# Altium project Elreg_Sender.PrjPCB
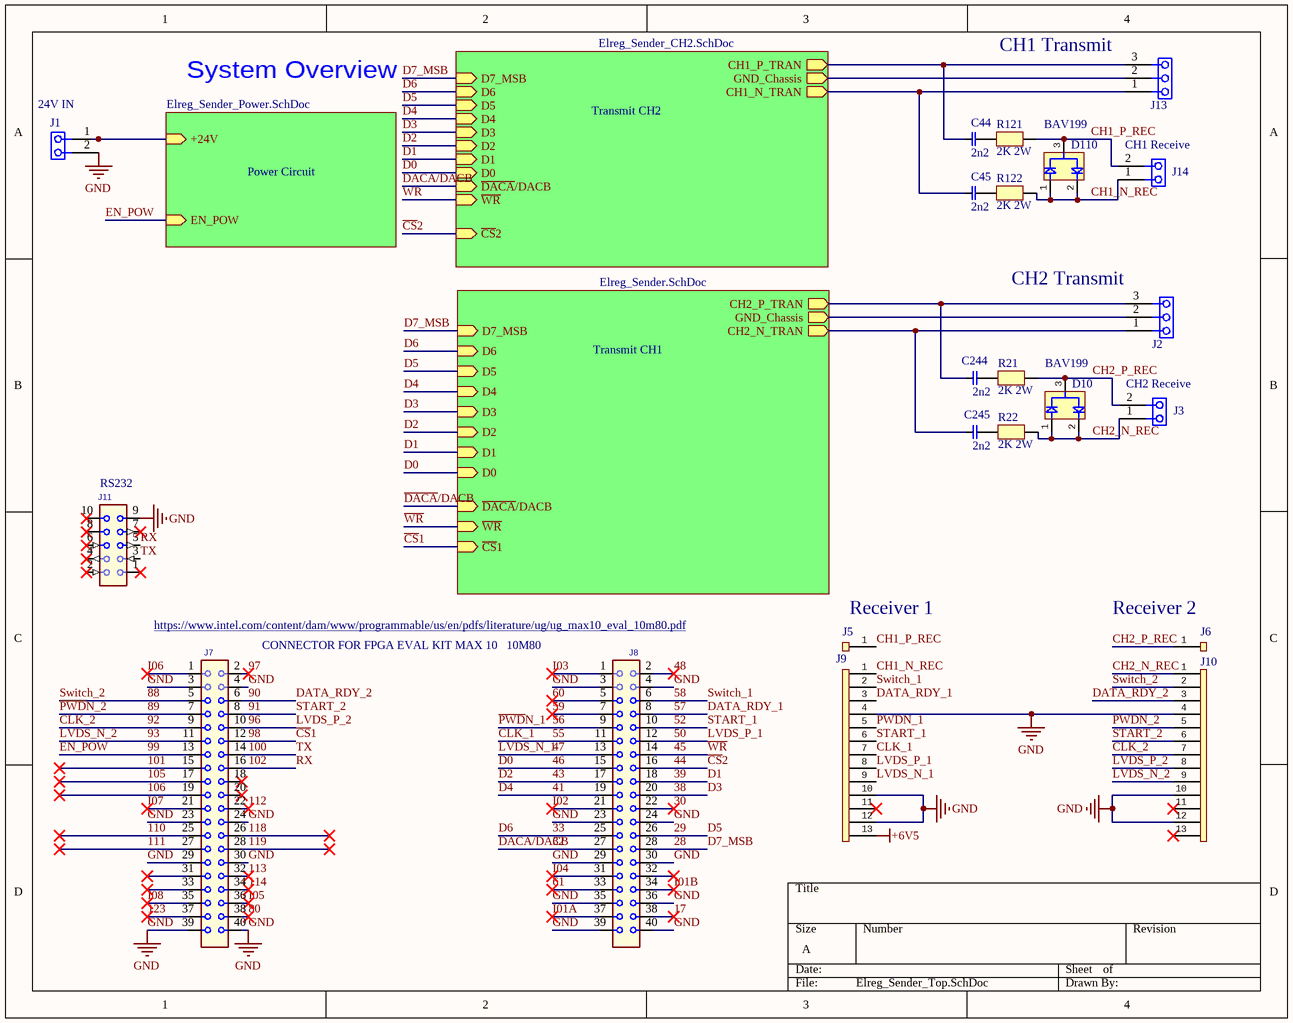
[diagram p0: Elreg_Sender_Top.SchDoc]
Revision: 1.0.1
4 sheets, 174 parts. Net scope: hierarchical (ports join the sheet entries above them; power ports are global).
Board file: Elreg_Sender.PcbDoc
Sheets:
  Elreg_Sender_Top.SchDoc
    Transmit CH1 = Elreg_Sender.SchDoc
    Power Circuit = Elreg_Sender_Power.SchDoc
    Transmit CH2 = Elreg_Sender_CH2.SchDoc

## Sheet Elreg_Sender_Top.SchDoc
size A; SheetNumber: 1

### Parts
C44  2n2  [CAP-1210]
C45  2n2  [CAP-1210]
C244  2n2  [CAP-1210]
C245  2n2  [CAP-1210]
D10  BAV199  [BAV199]
D110  BAV199  [BAV199]
J1  24V IN  [WAGO_2_pins]
J2  CONN 3x1  [WAGO-3_pins]  (value not drawn)
J3  CH2 Receive  [WAGO_2_pins]
J5  CON1_b  [CONN1 _b]  (value not drawn)
J6  CON1_b  [CONN1 _b]  (value not drawn)
J7  Header 2X20  [HEADER_2x20_2_54_1mm]  (value not drawn)
J8  Header 2X20  [HEADER_2x20_2_54_1mm]  (value not drawn)
J9  CON13  [CONN13]  (value not drawn)
J10  CON14  [CONN13]  (value not drawn)
J11  Header 2X5  [PIN-2X5-2.54-1.0]  (value not drawn)
J13  CONN 3x1  [WAGO-3_pins]  (value not drawn)
J14  CH1 Receive  [WAGO_2_pins]
R21  2K 2W  [RES2512]
R22  2K 2W  [RES2512]
R121  2K 2W  [RES2512]
R122  2K 2W  [RES2512]

### Sub-sheets
Power Circuit = Elreg_Sender_Power.SchDoc: +24V (in), EN_POW (in)
Transmit CH1 = Elreg_Sender.SchDoc: CH2_P_TRAN (out), CH2_N_TRAN (out), D0 (in), D1 (in), D2 (in), D3 (in), D4 (in), D5 (in), D6 (in), ~{CS}1 (in), ~{WR} (in), ~{DACA}/DACB (in), D7_MSB (in), GND_Chassis (out)
Transmit CH2 = Elreg_Sender_CH2.SchDoc: CH1_P_TRAN (out), CH1_N_TRAN (out), D0 (in), D1 (in), D2 (in), D3 (in), D4 (in), D5 (in), D6 (in), ~{WR} (in), ~{DACA}/DACB (in), D7_MSB (in), GND_Chassis (out), ~{CS}2 (in)

### Nets
+6V5: J9.13
GND: J1.2(Vout) J7.3(RX) J7.4(RTS) J7.23 J7.24 J7.29 J7.30 J7.39 J7.40 J8.3(RX) J8.4(RTS) J8.23 J8.24 J8.29 J8.30 J8.35 J8.36 J8.39 J8.40 J9.4 J9.10 J9.12 J10.4 J10.10 J10.12 J11.9(+PWR)
GND_chasis2: J13.2(Vout) ; sheet Transmit CH2/GND_Chassis
GND_chasis_1: J2.2(Vout) ; sheet Transmit CH1/GND_Chassis
17: J8.38
28: J8.28 ; sheet Transmit CH1/D7_MSB, sheet Transmit CH2/D7_MSB  [also labelled D7_MSB]
29: J8.26 ; sheet Transmit CH1/D5, sheet Transmit CH2/D5  [also labelled D5]
30: J8.22
32: J8.27 ; sheet Transmit CH1/~{DACA}/DACB, sheet Transmit CH2/~{DACA}/DACB  [also labelled ~{DACA}/DACB]
33: J8.25 ; sheet Transmit CH1/D6, sheet Transmit CH2/D6  [also labelled D6]
38: J8.20 ; sheet Transmit CH1/D3, sheet Transmit CH2/D3  [also labelled D3]
39: J8.18 ; sheet Transmit CH1/D1, sheet Transmit CH2/D1  [also labelled D1]
41: J8.19 ; sheet Transmit CH1/D4, sheet Transmit CH2/D4  [also labelled D4]
43: J8.17 ; sheet Transmit CH1/D2, sheet Transmit CH2/D2  [also labelled D2]
44: J8.16 ; sheet Transmit CH2/~{CS}2  [also labelled ~{CS}2]
45: J8.14 ; sheet Transmit CH1/~{WR}, sheet Transmit CH2/~{WR}  [also labelled ~{WR}]
46: J8.15 ; sheet Transmit CH1/D0, sheet Transmit CH2/D0  [also labelled D0]
47: J8.13 J9.9  [also labelled LVDS_N_1]
48: J8.2(DSR)
50: J8.12 J9.8  [also labelled LVDS_P_1]
52: J8.10 J9.6  [also labelled START_1]
55: J8.11 J9.7  [also labelled CLK_1]
56: J8.9(+PWR) J9.5  [also labelled ~{PWD}N_1]
57: J8.8 J9.3  [also labelled DATA_RDY_1]
58: J8.6(CTS) J9.2  [also labelled Switch_1]
59: J8.7(DTR)
60: J8.5(TX)
61: J8.33
80: J7.38
88: J7.5(TX) J10.2  [also labelled Switch_2]
89: J7.7(DTR) J10.5  [also labelled ~{PWD}N_2]
90: J7.6(CTS) J10.3  [also labelled DATA_RDY_2]
91: J7.8 J10.6  [also labelled START_2]
92: J7.9(+PWR) J10.7  [also labelled CLK_2]
93: J7.11 J10.9  [also labelled LVDS_N_2]
96: J7.10 J10.8  [also labelled LVDS_P_2]
97: J7.2(DSR)
98: J7.12 ; sheet Transmit CH1/~{CS}1  [also labelled ~{CS}1]
99: J7.13 ; sheet Power Circuit/EN_POW  [also labelled EN_POW]
100: J7.14 J11.3(RX)  [also labelled TX]
101: J7.15
102: J7.16 J11.5(TX)  [also labelled RX]
105: J7.17
106: J7.19
110: J7.25
111: J7.27
112: J7.22
113: J7.32
114: J7.34
118: J7.26
119: J7.28
123: J7.37
CH1_N_REC: D110.1(GND) D110.2(GND) J9.1 J14.1(Vout) R122.1(G)
CH1_P_REC: D110.3(GND) J5.1 J14.2(Vout) R121.1(G)
CH2_N_REC: D10.1(GND) D10.2(GND) J3.1(Vout) J10.1 R22.1(G)
CH2_P_REC: D10.3(GND) J3.2(Vout) J6.1 R21.1(G)
I01A: J8.37
I01B: J8.34
I02: J8.21
I03: J8.1
I04: J8.31
I05: J7.36
I06: J7.1
I07: J7.21
I08: J7.35
NetC44_1: C44.1(G) J13.3(Vout) ; sheet Transmit CH2/CH1_P_TRAN
NetC44_2: C44.2(G) R121.2(G)
NetC45_1: C45.1(G) J13.1(Vout) ; sheet Transmit CH2/CH1_N_TRAN
NetC45_2: C45.2(G) R122.2(G)
NetC244_1: C244.1(G) J2.3(Vout) ; sheet Transmit CH1/CH2_P_TRAN
NetC244_2: C244.2(G) R21.2(G)
NetC245_1: C245.1(G) J2.1(Vout) ; sheet Transmit CH1/CH2_N_TRAN
NetC245_2: C245.2(G) R22.2(G)
NetF1_1: J1.1(Vout) ; sheet Power Circuit/+24V

Not connected (* = marked no-connect by the designer): J7 18* 20* 31* 33*; J8 32*; J9 11(34)*; J10 11(34)* 13(36)*; J11 1* 2(DSR)* 4(RTS)* 6(CTS)* 7(DTR)* 8* 10*

### Notes on the sheet
- System Overview
- (near J13) CH1 Transmit
- (near J2) CH2 Transmit
- (near J11) RS232
- https://www.intel.com/content/dam/www/programmable/us/en/pdfs/literature/ug/ug_max10_eval_10m80.pdf
- (near J5) Receiver 1
- (near J6) Receiver 2
- (near J7) CONNECTOR FOR FPGA EVAL KIT MAX 10   10M80

### Library data of the parts
C44 C45 C244 C245 = C-1210: Manufacturer 1: Yageo; Manufacturer Part Number 1: CC1206KKX7RBBB332; Tolerance: ±10%; Voltage - Rated: 500V; Temperature Coefficient: X7R; Notification: Current market demand for these product types have resulted in fluctuating and extending lead times. Lead times may differ.; Description 1: CAP CER 3300PF 500V X7R 1206; Category 1: Capacitors; Packaging: Cut Tape (CT); Part Status: Active; Operating Temperature: -55°C ~ 125°C; Features: -; Ratings: -; Applications: General Purpose; Failure Rate: -; Mounting Type: Surface Mount, MLCC; Package / Case: 1206 (3216 Metric); Size / Dimension: 0.126" L x 0.063" W (3.20mm x 1.60mm); Height - Seated (Max): -; Thickness (Max): 0.057" (1.45mm); Lead Spacing: -; Lead Style: -; ComponentLink1URL: http://www.yageo.com/documents/recent/UPY-NP0X7R_MV_100-to-630V_21.pdf; ComponentLink1Description: http://www.yageo.com/documents/recent/UPY-NP0X7R_MV_100-to-630V_21.pdf; Supplier 1: Digi-Key; Supplier Part Number 1: 311-1506-1-ND; RoHS 1: RoHS Compliant; Stock 1: 4928; Pricing 1: 1=0.31, 10=0.214, 100=0.1085, 500=0.07424, 1000=0.06568 (USD)
J1 J3 J14 = 2x1 connector
J2 J13 = 3x1 connector
J7 J8 = HEADER_2x20_2.54_1: Manufacturer 1: TE Connectivity; Manufacturer Part Number 1: 826656-5; Description 1: Conn Unshrouded Header HDR 10 POS 2.54mm Solder ST Thru-Hole; Lead Time: 8 weeks; Peak Solder Temperature: 240 or 260 or 265 deg C; Supplier 1: Arrow; Supplier Part Number 1: 41579523S111189N5665; RoHS 1: CHINA ROHS: Compliant / EU ROHS: Compliant; Package Quantity: 4800; Termination Finish: Sn; EU_ROHS_PROD_EXEMPTION_BY_SUPP: N/R
J10 = CON13
J11 = HEADER_2x5_2.54: Conn Unshrouded Header HDR 10 POS 2.54mm Solder ST Thru-Hole; Manufacturer 1: TE Connectivity; Manufacturer Part Number 1: 826656-5; Lead Time: 8 weeks; Peak Solder Temperature: 240 or 260 or 265 deg C; Category 1: Connectors; Supplier 1: Arrow; Supplier Part Number 1: 41579523S111189N5665; RoHS 1: CHINA ROHS: Compliant / EU ROHS: Compliant; Description 1: Conn Unshrouded Header HDR 10 POS 2.54mm Solder ST Thru-Hole; Package Quantity: 4800; Termination Finish: Sn; EU_ROHS_PROD_EXEMPTION_BY_SUPP: N/R; ComponentLink1URL: http://components.arrow.com/partservice/dataview/altium/41579523S111189N5665?apiKey=aa438727d59eed98c4bed826d8d949c84cb5e685b92bf87346a0226bd2658797; ComponentLink1Description: http://components.arrow.com/partservice/dataview/altium/41579523S111189N5665?apiKey=aa438727d59eed98c4bed826d8d949c84cb5e685b92bf87346a0226bd2658797
R21 R22 R121 R122 = RES SMD 75K OHM 1% 2W 2512: Manufacturer 1: TE Connectivity Passive Product; Manufacturer Part Number 1: 352175KFT; Tolerance: ±1%; Temperature Coefficient: ±100ppm/°C; Category 1: Resistors; Packaging: Cut Tape (CT); Part Status: Active; Power (Watts): 2W; Composition: Thick Film; Features: -; Operating Temperature: -55°C ~ 155°C; Package / Case: 2512 (6432 Metric); Supplier Device Package: -; Size / Dimension: 0.248" L x 0.126" W (6.30mm x 3.20mm); Height - Seated (Max): 0.026" (0.65mm); Failure Rate: -; ComponentLink1URL: https://www.te.com/commerce/DocumentDelivery/DDEController?Action=srchrtrv&DocNm=9-1773463-5&DocType=DS&DocLang=English; ComponentLink1Description: https://www.te.com/commerce/DocumentDelivery/DDEController?Action=srchrtrv&DocNm=9-1773463-5&DocType=DS&DocLang=English; Supplier 1: Digi-Key; Supplier Part Number 1: A116077CT-ND; RoHS 1: RoHS Compliant; Description 1: RES SMD 75K OHM 1% 2W 2512; Stock 1: 1551; Pricing 1: 1=0.71, 10=0.521, 100=0.3037, 1000=0.17031 (USD)

## Sheet Elreg_Sender.SchDoc
size A; SheetNumber: 2
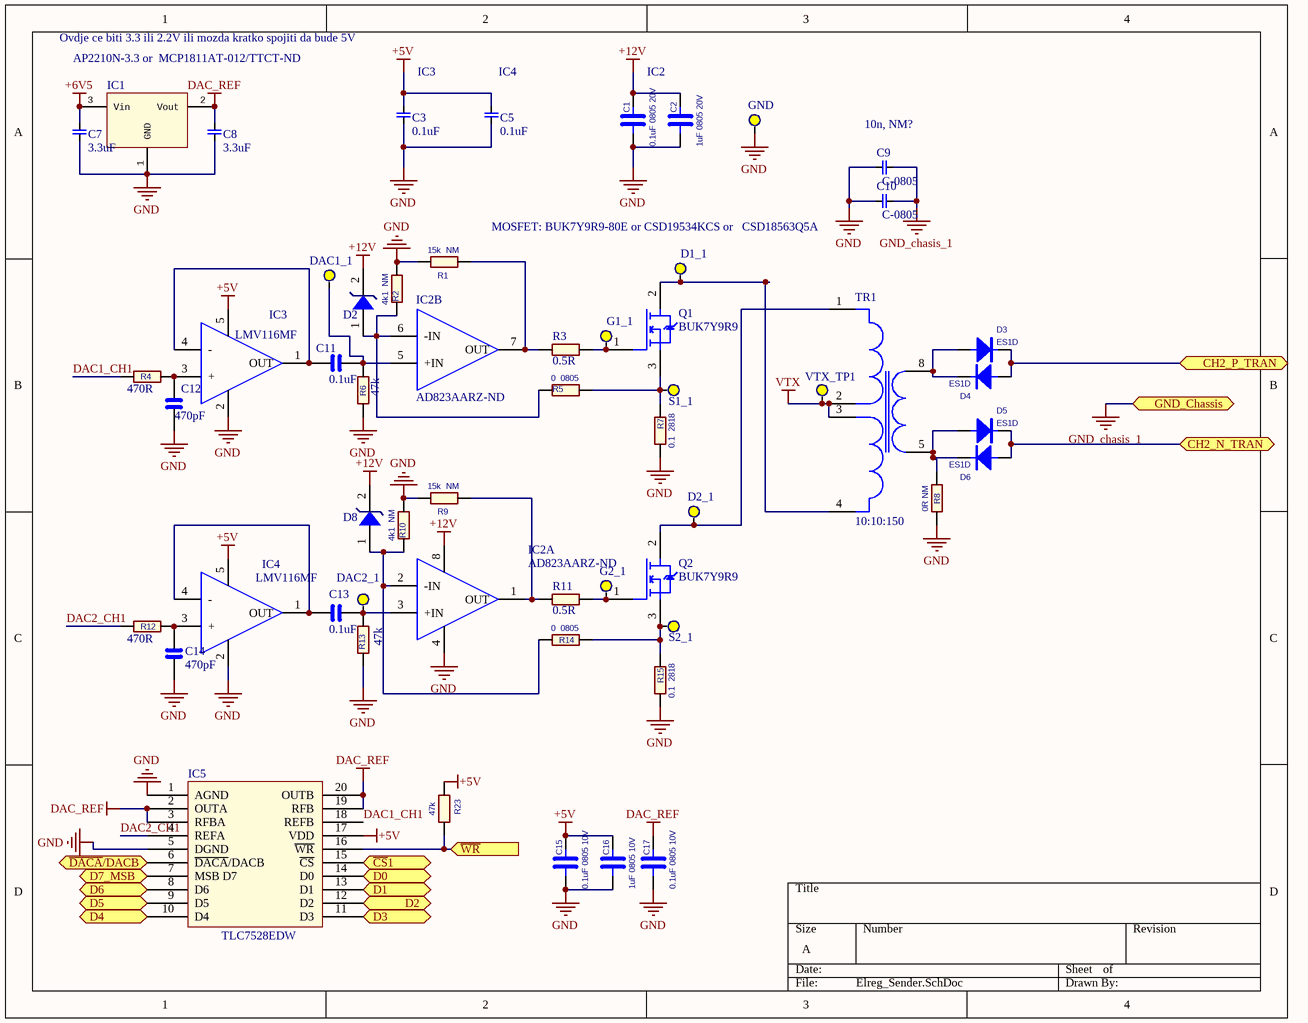
[diagram p1: Elreg_Sender.SchDoc]

### Parts
C1  0.1uF 0805 20V  [C-0603]
C2  1uF 0805 20V  [C-0603]
C3  0.1uF  [C-0603]
C5  0.1uF  [C-0603]
C7  3.3uF  [C-0805]
C8  3.3uF  [C-0805]
C9  C-0805  [C-0805]
C10  C-0805  [C-0805]
C11  0.1uF  [C-0603]
C12  470pF  [C-0603]
C13  0.1uF  [C-0603]
C14  470pF  [C-0603]
C15  0.1uF 0805 10V  [C-0603]
C16  1uF 0805 10V  [C-0603]
C17  0.1uF 0805 10V  [C-0603]
D1_1  Test_Point  [Test_Point]  (value not drawn)
D2  Zener 12V  [DFN380P520X45-2N]  (value not drawn)
D2_1  Test_Point  [Test_Point]  (value not drawn)
D3  ES1D  [SMA]
D4  ES1D  [SMA]
D5  ES1D  [SMA]
D6  ES1D  [SMA]
D8  Zener 12V  [DFN380P520X45-2N]  (value not drawn)
DAC1_1  DAC1  [Test_Point]  (value not drawn)
DAC2_1  DAC2_1  [Test_Point]  (value not drawn)
G1_1  Test_Point  [Test_Point]  (value not drawn)
G2_1  Test_Point  [Test_Point]  (value not drawn)
IC1  AP2210N-3.3 or  MCP1811AT-012/TTCT-ND  [SOT23-3]
IC2  AD823AARZ-ND  [TSOP65P280X110-8N]  (parts A,B of 2)
IC3  LMV116MF  [SOT-23-5]
IC4  LMV116MF  [SOT-23-5]
IC5  TLC7528EDW  [SOIC-20]
Q1  BUK7Y9R9  [BUK7Y9R)]
Q2  BUK7Y9R9  [BUK7Y9R)]
R1  15k  NM  [R-0603]
R2  4k1  NM  [R-0603]
R3  0.5R  [R-0603]
R4  470R  [R-0603]
R5  0  0805  [R-0603]
R6  47k  [R-0603]
R7  0.1  2818  [RES2818]
R8  0R NM  [RES-0805]
R9  15k  NM  [R-0603]
R10  4k1  NM  [R-0603]
R11  0.5R  [R-0603]
R12  470R  [R-0603]
R13  47k  [R-0603]
R14  0  0805  [R-0603]
R15  0.1  2818  [RES2818]
R23  47k  [R-0603]
S1_1  Test_Point  [Test_Point]  (value not drawn)
S2_1  Test_Point  [Test_Point]  (value not drawn)
TP1  GND  [Test_Point]
TR1  10:10:150  [Trafo_15x15]
VTX_TP1  Test_Point  [Test_Point]  (value not drawn)

### Ports
CH2_N_TRAN (bidir), CH2_P_TRAN (bidir), D0 (in), D1 (in), D2 (in), D3 (in), D4 (in), D5 (in), D6 (in), D7_MSB (in), GND_Chassis (bidir), ~{CS}1 (in), ~{DACA}/DACB (in), ~{WR} (in)

### Nets
+5V: C3.2(G) C5.2(G) C15.2 C16.2 IC3.5(+Vs) IC4.5(+Vs) IC5.17(VDD) R23.2
+6V5: C7.2(G) IC1.3(Vin)
+12V: C1.2 C2.2 D2.2(A) D8.2(A) IC2.8(+Vs)
DAC_REF: C8.2(G) C17.2 IC1.2(Vout) IC5.2(OUTA) IC5.3(RFBA) IC5.19(RFB) IC5.20(OUTB)
GND: C1.1 C2.1 C3.1(G) C5.1(G) C7.1(G) C8.1(G) C9.1(G) C10.1(G) C12.2 C14.1 C15.1 C16.1 C17.1 IC1.1(GND) IC2.4(-Vs) IC3.2(-Vs) IC4.2(-Vs) IC5.1(AGND) IC5.5(DGND) R1.1 R2.2 R6.1 R7.2 R8.1 R9.1 R10.2 R13.2 R15.2 TP1.1
GND_chasis_1: C9.2(G) C10.2(G) ; port GND_Chassis
VTX: TR1.2(G) TR1.3(G) VTX_TP1.1
28: IC5.7(MSB_D7) ; port D7_MSB
29: IC5.9(D5) ; port D5
32: IC5.6(~{DACA}/DACB) ; port ~{DACA}/DACB
33: IC5.8(D6) ; port D6
38: IC5.11(D3) ; port D3
39: IC5.13(D1) ; port D1
41: IC5.10(D4) ; port D4
43: IC5.12(D2) ; port D2
45: IC5.16(~{WR}) R23.1 ; port ~{WR}
46: IC5.14(D0) ; port D0
98: IC5.15(~{CS}) ; port ~{CS}1
DAC1_CH1: IC5.18(REFB) R4.1
DAC2_CH1: IC5.4(REFA) R12.1
NetC11_1: C11.1 DAC1_1.1 IC2.5(+IN) R6.2
NetC11_2: C11.2 IC3.1(OUT) IC3.4(-)
NetC12_1: C12.1 IC3.3(+) R4.2
NetC13_1: C13.1 DAC2_1.1 IC2.3(+IN) R13.1
NetC13_2: C13.2 IC4.1(OUT) IC4.4(-)
NetC14_2: C14.2 IC4.3(+) R12.2
NetC244_1: D3.2(C) D4.1(A) ; port CH2_P_TRAN
NetC245_1: D5.2(C) D6.1(A) ; port CH2_N_TRAN
NetD1_1_1: D1_1.1 Q1.2(G) TR1.4(G)
NetD2_1: D2.1(A) IC2.6(-IN) R2.1 R5.1
NetD2_1_1: D2_1.1 Q2.2(G) TR1.1(G)
NetD3_1: D3.1(A) D4.2(C) TR1.8(G)
NetD5_1: D5.1(A) D6.2(C) R8.2 TR1.5(G)
NetD8_1: D8.1(A) IC2.2(-IN) R10.1 R14.1
NetG1_1_1: G1_1.1 Q1.1(G) R3.2
NetG2_1_1: G2_1.1 Q2.1(G) R11.2
NetIC2_1: IC2.1(OUT) R9.2 R11.1
NetIC2_7: IC2.7(OUT) R1.2 R3.1
NetQ1_3: Q1.3(G) R5.2 R7.1 S1_1.1
NetQ2_3: Q2.3(G) R14.2 R15.1 S2_1.1

### Notes on the sheet
- Ovdje ce biti 3.3 ili 2.2V ili mozda kratko spojiti da bude 5V
- (near C3) IC3
- (near C5) IC4
- IC2
- (near C9) 10n, NM?
- MOSFET: BUK7Y9R9-80E or CSD19534KCS or   CSD18563Q5A

### Library data of the parts
C1 C2 C15-C17 = 0805CAPxxrrrrv: CAP CER rrrrUF xV x% type 0805
C3 C5 C7 C8 = C-0805_3_3uF: Manufacturer 1: Yageo; Manufacturer Part Number 1: CC1206KKX7RBBB332; Tolerance: ±10%; Voltage - Rated: 500V; Temperature Coefficient: X7R; Notification: Current market demand for these product types have resulted in fluctuating and extending lead times. Lead times may differ.; Description 1: CAP CER 3300PF 500V X7R 1206; Category 1: Capacitors; Packaging: Cut Tape (CT); Part Status: Active; Operating Temperature: -55°C ~ 125°C; Features: -; Ratings: -; Applications: General Purpose; Failure Rate: -; Mounting Type: Surface Mount, MLCC; Package / Case: 1206 (3216 Metric); Size / Dimension: 0.126" L x 0.063" W (3.20mm x 1.60mm); Height - Seated (Max): -; Thickness (Max): 0.057" (1.45mm); Lead Spacing: -; Lead Style: -; ComponentLink1URL: http://www.yageo.com/documents/recent/UPY-NP0X7R_MV_100-to-630V_21.pdf; ComponentLink1Description: http://www.yageo.com/documents/recent/UPY-NP0X7R_MV_100-to-630V_21.pdf; Supplier 1: Digi-Key; Supplier Part Number 1: 311-1506-1-ND; RoHS 1: RoHS Compliant; Stock 1: 4928; Pricing 1: 1=0.31, 10=0.214, 100=0.1085, 500=0.07424, 1000=0.06568 (USD)
C9 C10 = C-0805: Manufacturer 1: Yageo; Manufacturer Part Number 1: CC1206KKX7RBBB332; Tolerance: ±10%; Voltage - Rated: 500V; Temperature Coefficient: X7R; Notification: Current market demand for these product types have resulted in fluctuating and extending lead times. Lead times may differ.; Description 1: CAP CER 3300PF 500V X7R 1206; Category 1: Capacitors; Packaging: Cut Tape (CT); Part Status: Active; Operating Temperature: -55°C ~ 125°C; Features: -; Ratings: -; Applications: General Purpose; Failure Rate: -; Mounting Type: Surface Mount, MLCC; Package / Case: 1206 (3216 Metric); Size / Dimension: 0.126" L x 0.063" W (3.20mm x 1.60mm); Height - Seated (Max): -; Thickness (Max): 0.057" (1.45mm); Lead Spacing: -; Lead Style: -; ComponentLink1URL: http://www.yageo.com/documents/recent/UPY-NP0X7R_MV_100-to-630V_21.pdf; ComponentLink1Description: http://www.yageo.com/documents/recent/UPY-NP0X7R_MV_100-to-630V_21.pdf; Supplier 1: Digi-Key; Supplier Part Number 1: 311-1506-1-ND; RoHS 1: RoHS Compliant; Stock 1: 4928; Pricing 1: 1=0.31, 10=0.214, 100=0.1085, 500=0.07424, 1000=0.06568 (USD)
C11 C13 = C-0603_0_1u_10V: CAP CER 0.1UF 10V X7R 0603; Manufacturer Part Number: 885012206020
C12 C14 = C-0603_470p_10V: CAP CER 470p 10V C0G/NP0 0603; Manufacturer Part Number: 885012006014
D2 D8 = Zener 12V: Manufacturer 1: Comchip Technology; Manufacturer Part Number 1: CDBA140-G; Description 1: DIODE SCHOTTKY 40V 1A DO214AC; Category 1: Discrete Semiconductor Products; Diode Type: Schottky; Current - Average Rectified (Io): 1A; Speed: Fast Recovery =< 500ns, > 200mA (Io); Supplier 1: Digi-Key; Supplier Part Number 1: 641-1015-1-ND; RoHS 1: RoHS Compliant; Stock 1: 527910; Pricing 1: 1=0.37, 10=0.338, 100=0.1893, 500=0.1014, 1000=0.06895 (USD); Packaging: Cut Tape (CT); Part Status: Active; Capacitance @ Vr, F: -; Mounting Type: Surface Mount; Package / Case: DO-214AC, SMA; Supplier Device Package: DO-214AC (SMA); Operating Temperature - Junction: -65°C ~ 125°C; Base Part Number: CDBA140; ComponentLink1URL: http://www.comchiptech.com/admin/files/product/CDBA140-HF%20Thru192841.%20CDBA1100-HF%20RevB.pdf; ComponentLink1Description: http://www.comchiptech.com/admin/files/product/CDBA140-HF%20Thru192841.%20CDBA1100-HF%20RevB.pdf
D3-D6 = ES1x: Diode; Manufacturer: Fairchild/ON Semiconductor; Diode Type: Standard; Voltage - DC Reverse (Vr) (Max): 200V; Current - Average Rectified (Io): 1A; Voltage - Forward (Vf) (Max) @ If: 920mV @ 1A; Speed: Fast Recovery =< 500ns, > 200mA (Io); Reverse Recovery Time (trr): 15ns; Current - Reverse Leakage @ Vr: 5μA @ 200V; Capacitance @ Vr, F: 7pF @ 4V, 1MHz; Supplier 1: Digi-Key; Supplier Part Number 1: ES1DFSTR-ND; Manufacturer Part Number: ES1D; RoHS: RoHS Compliant; Category: Discrete Semiconductor Products; Stock 1: 135000; Pricing 1: 7500=0.0567, 15000=0.0504, 37500=0.04725, 52500=0.0419, 187500=0.04032 (USD); Packaging: Tape & Reel (TR); Part Status: Active; Mounting Type: Surface Mount; Package / Case: DO-214AC, SMA; Supplier Device Package: SMA (DO-214AC); Operating Temperature - Junction: -55°C ~ 150°C; ComponentLink1URL: https://www.fairchildsemi.com/datasheets/ES/ES1A.pdf; ComponentLink1Description: https://www.fairchildsemi.com/datasheets/ES/ES1A.pdf
DAC1_1 DAC2_1 TP1 = Test_Point
IC1 = AP2210N-3.3: AP2210N-3.3TRG1DICT-ND
IC2 = AD823AARZ-ND: IC OPAMP JFET 16MHZ RRO 8-MSOP; Supplier 1: Digi-Key; Supplier Part Number 1: AD823ARZ-ND
R1 R2 R5 R8-R10 R14 R23 = CRCW0805xxxxJN Default: RES xx OHM 1/8W 5% 0805 SMD; Category 1: Resistors
R3 R11 = RES-0805
R4 R12 = R-0603_470R: RES SMD 470 OHM 1% 0.4W 0805; Manufacturer 1: Vishay Dale; Manufacturer Part Number 1: CRCW0805150RJNEA; Manufacturer Part Number: ESR10EZPF1001; Description 1: RES 150 OHM 1/8W 5% 0805 SMD; Category 1: Resistors; Tolerance: ±5%; Power (Watts): 0.125W, 1/8W; Temperature Coefficient: ±200ppm/°C; Description 2: Thick Film Resistors - SMD 1/8watt 150ohms 5% 200ppm; Category 2: Thick Film Resistors - SMD; Power Rating: 125 mW (1/8 W); Resistance: 150 Ohms; Voltage Rating: 150 V; Description 3: VISHAY DALE - CRCW0805150RJNEA - RESISTOR, THICK FILM, 150 OHM, 125mW, 5%; Product Range: VISHAY - CRCW Series; Resistance Tolerance: ± 5%; Resistor Case Style: 0805 ^2012 Metric]; Resistor Element Type: Thick Film; No. of Pins: 2; Resistance (Ohms): 150; Supplier 1: Digi-Key; Supplier Part Number 1: 541-150ADKR-ND; RoHS 1: RoHS Compliant; Packaging: Digi-Reel®; Composition: Thick Film; Features: Automotive AEC-Q200 Qualified; Package / Case: 0805 (2012 Metric); Supplier Device Package: 0805 (2012 Metric); Size / Dimension: 0.079" L x 0.049" W (2.00mm x 1.25mm); Height: 0.020" (0.50mm); ComponentLink1URL: http://www.vishay.com/doc?20035; ComponentLink1Description: http://www.vishay.com/doc?20035; Supplier 2: Mouser; Supplier Part Number 2: 71-CRCW0805150RJNEA; Manufacturer 2: Vishay; Manufacturer Part Number 2: CRCW0805150RJNEA; RoHS 2: RoHS Compliant By Exemption; Dimensions: 1.25 mm W x 2 mm L x 0.45 mm H; Operating Temperature Range: - 55 C to + 155 C; Product: Thick Film Resistors SMD; Series: CRCW; Termination Style: SMD/SMT; Case Code - in: 0805; Case Code - mm: 2012; Product Category: 0805 Thick Film Chip Resistors; Standard Pack Qty: 5000; RoHS - Mouser: E; Minimum Order Quantity: 1; Reeling: True; ComponentLink2URL: http://www.mouser.com/ds/2/427/dcrcwe3-109170.pdf; ComponentLink2Description: http://www.mouser.com/ds/2/427/dcrcwe3-109170.pdf; Supplier 3: Farnell; Supplier Part Number 3: 1514819; Manufacturer 3: VISHAY DALE; Manufacturer Part Number 3: CRCW0805150RJNEA; RoHS 3: YES; ComponentLink3URL: http://www.farnell.com/cad/1552534.zip; ComponentLink3Description: http://www.farnell.com/cad/1552534.zip
R6 R13 = R-0603_47k: RES SMD 47k 1% 0.4W 0805; Manufacturer 1: Vishay Dale; Manufacturer Part Number 1: CRCW0805150RJNEA; Manufacturer Part Number: ESR10EZPF1001; Description 1: RES 150 OHM 1/8W 5% 0805 SMD; Category 1: Resistors; Tolerance: ±5%; Power (Watts): 0.125W, 1/8W; Temperature Coefficient: ±200ppm/°C; Description 2: Thick Film Resistors - SMD 1/8watt 150ohms 5% 200ppm; Category 2: Thick Film Resistors - SMD; Power Rating: 125 mW (1/8 W); Resistance: 150 Ohms; Voltage Rating: 150 V; Description 3: VISHAY DALE - CRCW0805150RJNEA - RESISTOR, THICK FILM, 150 OHM, 125mW, 5%; Product Range: VISHAY - CRCW Series; Resistance Tolerance: ± 5%; Resistor Case Style: 0805 ^2012 Metric]; Resistor Element Type: Thick Film; No. of Pins: 2; Resistance (Ohms): 150; Supplier 1: Digi-Key; Supplier Part Number 1: 541-150ADKR-ND; RoHS 1: RoHS Compliant; Packaging: Digi-Reel®; Composition: Thick Film; Features: Automotive AEC-Q200 Qualified; Package / Case: 0805 (2012 Metric); Supplier Device Package: 0805 (2012 Metric); Size / Dimension: 0.079" L x 0.049" W (2.00mm x 1.25mm); Height: 0.020" (0.50mm); ComponentLink1URL: http://www.vishay.com/doc?20035; ComponentLink1Description: http://www.vishay.com/doc?20035; Supplier 2: Mouser; Supplier Part Number 2: 71-CRCW0805150RJNEA; Manufacturer 2: Vishay; Manufacturer Part Number 2: CRCW0805150RJNEA; RoHS 2: RoHS Compliant By Exemption; Dimensions: 1.25 mm W x 2 mm L x 0.45 mm H; Operating Temperature Range: - 55 C to + 155 C; Product: Thick Film Resistors SMD; Series: CRCW; Termination Style: SMD/SMT; Case Code - in: 0805; Case Code - mm: 2012; Product Category: 0805 Thick Film Chip Resistors; Standard Pack Qty: 5000; RoHS - Mouser: E; Minimum Order Quantity: 1; Reeling: True; ComponentLink2URL: http://www.mouser.com/ds/2/427/dcrcwe3-109170.pdf; ComponentLink2Description: http://www.mouser.com/ds/2/427/dcrcwe3-109170.pdf; Supplier 3: Farnell; Supplier Part Number 3: 1514819; Manufacturer 3: VISHAY DALE; Manufacturer Part Number 3: CRCW0805150RJNEA; RoHS 3: YES; ComponentLink3URL: http://www.farnell.com/cad/1552534.zip; ComponentLink3Description: http://www.farnell.com/cad/1552534.zip
R7 R15 = CRCW0805xxxxJN Default: 0.1Ohm 10W; Manufacturer part number:: WSHP2818R1000FEB
TR1 = TRAFO_15x15: Coil Forme: B66414B6008T001; Yoke: B66414B2000X000; Cover Plate: B66414A7000X000; link PDF: https://www.tdk-electronics.tdk.com/inf/80/db/fer/efd_15_8_5.pdf

## Sheet Elreg_Sender_Power.SchDoc
size A; SheetNumber: 3
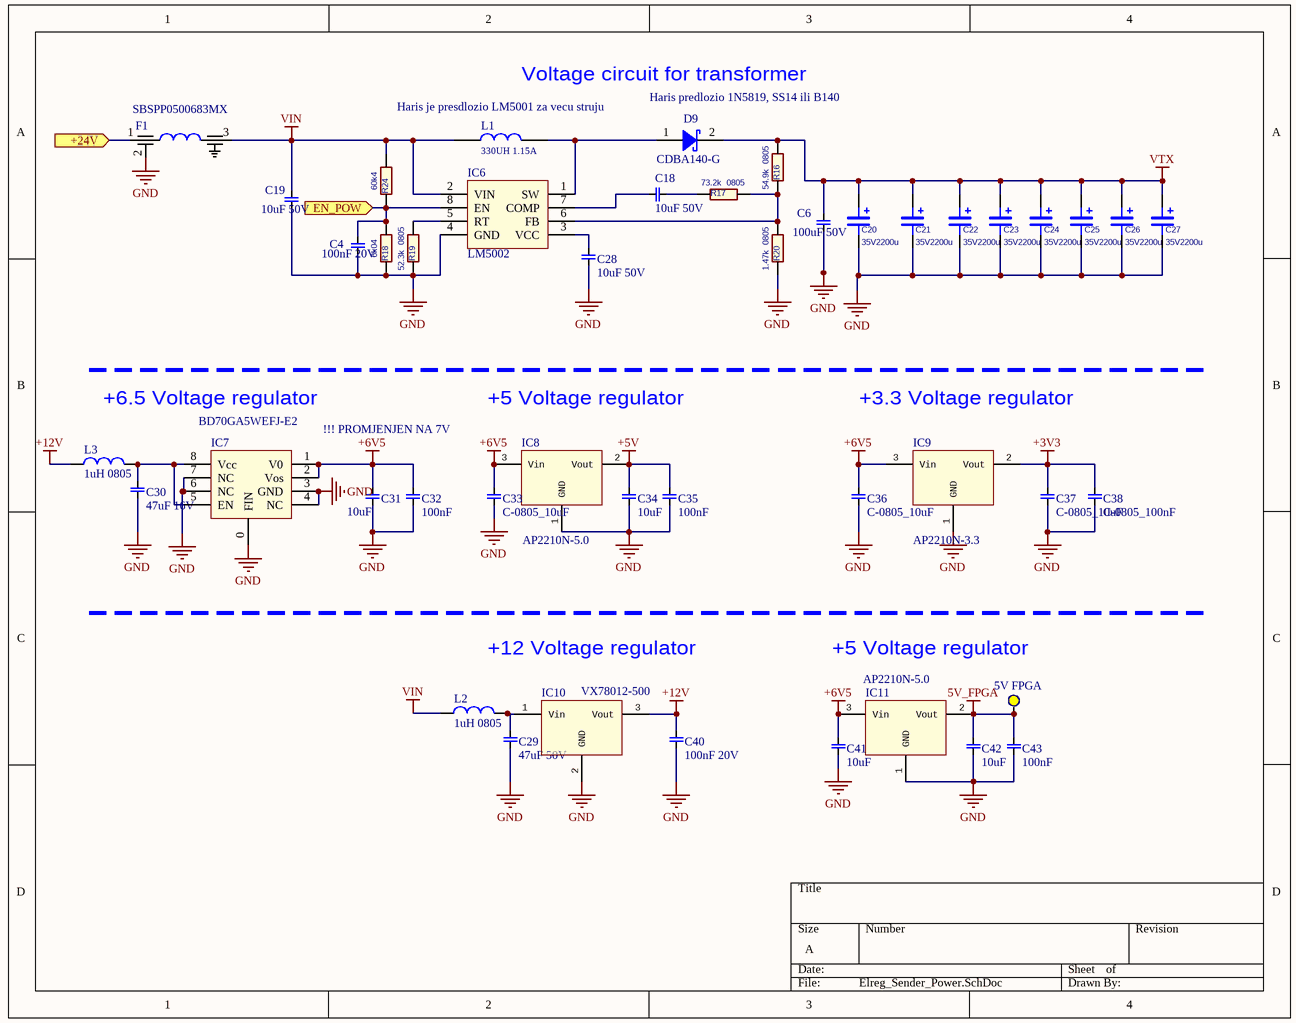
[diagram p2: Elreg_Sender_Power.SchDoc]

### Parts
C4  100nF 20V  [C-0603]
C6  100uF 50V  [C-0805]
C18  10uF 50V  [C-0603]
C19  10uF 50V  [C-0805]
C20  35V2200u  [CAP_16X25]
C21  35V2200u  [CAP_16X25]
C22  35V2200u  [CAP_16X25]
C23  35V2200u  [CAP_16X25]
C24  35V2200u  [CAP_16X25]
C25  35V2200u  [CAP_16X25]
C26  35V2200u  [CAP_16X25]
C27  35V2200u  [CAP_16X25]
C28  10uF 50V  [C-0603]
C29  47uF 50V  [C-0603]
C30  47uF 16V  [C-0603]
C31  10uF  [C-0603]
C32  100nF  [C-0603]
C33  C-0805_10uF  [C-0603]
C34  10uF  [C-0603]
C35  100nF  [C-0603]
C36  C-0805_10uF  [C-0805]
C37  C-0805_10uF  [C-0805]
C38  C-0805_100nF  [C-0805]
C40  100nF 20V  [C-0805]
C41  10uF  [C-0603]
C42  10uF  [C-0603]
C43  100nF  [C-0603]
D9  Manufacturer Part Number 1: CDBA140-G  [DFN380P520X45-2N]  (hidden comment: DIODE SCHOTTKY 40V 1A DO214AC)
F1  SBSPP0500683MX  [Filter_SBSPP0500]
IC6  LM5002  [SOIC127P600X205-8N]
IC7  BD70GA5WEFJ-E2  [HTSOP-J8]  (value not drawn)
IC8  AP2210N-5.0  [SOT23-3]
IC9  AP2210N-3.3  [SOT23-3]
IC10  VX78012-500  [VREG]
IC11  AP2210N-5.0  [SOT23-3]
L1  330UH 1.15A  [IND]
L2  1uH 0805  [0805]
L3  1uH 0805  [0805]
R16  54.9k  0805  [R-0603]
R17  73.2k  0805  [R-0603]
R18  6k04  [R-0603]
R19  52.3k  0805  [R-0603]
R20  1.47k  0805  [R-0603]
R24  60k4  [R-0603]
TP5  5V FPGA  [Test_Point]

### Ports
+24V (in), EN_POW (in)

### Nets
5V_FPGA: C42.1(G) C43.2(G) IC11.2(Vout) TP5.1
+3V3: C37.1(G) C38.2(G) IC9.2(Vout)
+5V: C34.1(G) C35.2(G) IC8.2(Vout)
+6V5: C31.1(G) C32.2(G) C33.1(G) C36.1(G) C41.1(G) IC7.1(V0) IC7.2(Vos) IC8.3(Vin) IC9.3(Vin) IC11.3(Vin)
+12V: C40.2(G) IC10.3(Vout) L3.1(A)
GND: C4.1(G) C6.2(G) C19.2(G) C20.2 C21.2 C22.2 C23.2 C24.2 C25.2 C26.2 C27.2 C28.2(G) C29.2(G) C30.1(G) C31.2(G) C32.1(G) C33.2(G) C34.2(G) C35.1(G) C36.2(G) C37.2(G) C38.1(G) C40.1(G) C41.2(G) C42.2(G) C43.1(G) F1.2 IC6.4(GND) IC7.0(FIN) IC7.3(GND) IC7.4(NC) IC7.6(NC) IC7.7(NC) IC8.1(GND) IC9.1(GND) IC10.2(GND) IC11.1(GND) R18.1 R19.1 R20.1
VIN: C19.1(G) F1.3 IC6.2(VIN) L1.1(A) L2.1(A) R24.2
VTX: C6.1(G) C20.1 C21.1 C22.1 C23.1 C24.1 C25.1 C26.1 C27.1 D9.2(A) R16.2
99: C4.2(G) IC6.8(EN) R18.2 R24.1 ; port EN_POW
NetC18_1: C18.1(G) IC6.7(COMP)
NetC18_2: C18.2(G) R17.1
NetC28_1: C28.1(G) IC6.3(VCC)
NetC29_1: C29.1(G) IC10.1(Vin) L2.2(A)
NetC30_2: C30.2(G) IC7.5(EN) IC7.8(Vcc) L3.2(A)
NetD9_1: D9.1(A) IC6.1(SW) L1.2(A)
NetF1_1: F1.1 ; port +24V
NetIC6_5: IC6.5(RT) R19.2
NetIC6_6: IC6.6(FB) R16.1 R17.2 R20.2

### Notes on the sheet
- Voltage circuit for transformer
- Haris predlozio 1N5819, SS14 ili B140
- (near L1) Haris je presdlozio LM5001 za vecu struju
- +6.5 Voltage regulator
- (near IC7) BD70GA5WEFJ-E2
- !!! PROMJENJEN NA 7V
- +5 Voltage regulator
- +3.3 Voltage regulator
- +12 Voltage regulator

### Library data of the parts
C4 C32 C35 C38 C40 C43 = C-0805_100nF: Manufacturer 1: Yageo; Manufacturer Part Number 1: CC1206KKX7RBBB332; Tolerance: ±10%; Voltage - Rated: 500V; Temperature Coefficient: X7R; Notification: Current market demand for these product types have resulted in fluctuating and extending lead times. Lead times may differ.; Description 1: CAP CER 3300PF 500V X7R 1206; Category 1: Capacitors; Packaging: Cut Tape (CT); Part Status: Active; Operating Temperature: -55°C ~ 125°C; Features: -; Ratings: -; Applications: General Purpose; Failure Rate: -; Mounting Type: Surface Mount, MLCC; Package / Case: 1206 (3216 Metric); Size / Dimension: 0.126" L x 0.063" W (3.20mm x 1.60mm); Height - Seated (Max): -; Thickness (Max): 0.057" (1.45mm); Lead Spacing: -; Lead Style: -; ComponentLink1URL: http://www.yageo.com/documents/recent/UPY-NP0X7R_MV_100-to-630V_21.pdf; ComponentLink1Description: http://www.yageo.com/documents/recent/UPY-NP0X7R_MV_100-to-630V_21.pdf; Supplier 1: Digi-Key; Supplier Part Number 1: 311-1506-1-ND; RoHS 1: RoHS Compliant; Stock 1: 4928; Pricing 1: 1=0.31, 10=0.214, 100=0.1085, 500=0.07424, 1000=0.06568 (USD)
C6 C18 C19 C28 C29 C31 C33 C34 C36 C37 C41 C42 = C-0805_10uF: Manufacturer 1: Yageo; Manufacturer Part Number 1: CC1206KKX7RBBB332; Tolerance: ±10%; Voltage - Rated: 500V; Temperature Coefficient: X7R; Notification: Current market demand for these product types have resulted in fluctuating and extending lead times. Lead times may differ.; Description 1: CAP CER 3300PF 500V X7R 1206; Category 1: Capacitors; Packaging: Cut Tape (CT); Part Status: Active; Operating Temperature: -55°C ~ 125°C; Features: -; Ratings: -; Applications: General Purpose; Failure Rate: -; Mounting Type: Surface Mount, MLCC; Package / Case: 1206 (3216 Metric); Size / Dimension: 0.126" L x 0.063" W (3.20mm x 1.60mm); Height - Seated (Max): -; Thickness (Max): 0.057" (1.45mm); Lead Spacing: -; Lead Style: -; ComponentLink1URL: http://www.yageo.com/documents/recent/UPY-NP0X7R_MV_100-to-630V_21.pdf; ComponentLink1Description: http://www.yageo.com/documents/recent/UPY-NP0X7R_MV_100-to-630V_21.pdf; Supplier 1: Digi-Key; Supplier Part Number 1: 311-1506-1-ND; RoHS 1: RoHS Compliant; Stock 1: 4928; Pricing 1: 1=0.31, 10=0.214, 100=0.1085, 500=0.07424, 1000=0.06568 (USD)
C20-C27 = CAP_2200uF_35V: Capacitor; Manufacturer: Kemet; Manufacturer Part Number: ESH228M035AM7AA; Capacitance: 2200µF; Tolerance: ±20%; Voltage Rating: 35V; Lifetime @ Temp.: 2000 Hrs @ 105°C; Supplier 1: Digi-Key; Supplier Part Number 1: 399-6572-ND; RoHS: RoHS Compliant; Category: Capacitors; Stock 1: 1972; Pricing 1: 1=0.98, 10=0.77, 50=0.6676, 100=0.5778, 250=0.5136, 500=0.43656, 1000=0.3852, 2500=0.35952, 5000=0.34668 (USD); Packaging: Bulk; ESR (Equivalent Series Resistance): -; Operating Temperature: -40°C ~ 105°C; Type: -; Applications: General Purpose; Ripple Current: -; Impedance: -; Lead Spacing: 0.295" (7.50mm); Size / Dimension: 0.630" Dia (16.00mm); Height - Seated (Max): 1.063" (27.00mm); Surface Mount Land Size: -; Mounting Type: Through Hole; Package / Case: Radial, Can; ComponentLink1URL: http://www.kemet.com/docfinder?Partnumber=ESH228M035AM7AA; ComponentLink1Description: http://www.kemet.com/docfinder?Partnumber=ESH228M035AM7AA
C30 = C-0805_3_3uF: as C3 on sheet Elreg_Sender; Packaging: Cut Tape (CT); Part Status: Active; Operating Temperature: -55°C ~ 125°C; Features: -; Ratings: -; Applications: General Purpose; Failure Rate: -; Mounting Type: Surface Mount, MLCC; Package / Case: 1206 (3216 Metric); Size / Dimension: 0.126" L x 0.063" W (3.20mm x 1.60mm); Height - Seated (Max): -; Thickness (Max): 0.057" (1.45mm); Lead Spacing: -; Lead Style: -; ComponentLink1URL: http://www.yageo.com/documents/recent/UPY-NP0X7R_MV_100-to-630V_21.pdf; ComponentLink1Description: http://www.yageo.com/documents/recent/UPY-NP0X7R_MV_100-to-630V_21.pdf; Supplier 1: Digi-Key; Supplier Part Number 1: 311-1506-1-ND; RoHS 1: RoHS Compliant; Stock 1: 4928; Pricing 1: 1=0.31, 10=0.214, 100=0.1085, 500=0.07424, 1000=0.06568 (USD)
D9 = DIODE SCHOTTKY 40V 1A DO214AC: Manufacturer 1: Comchip Technology; Category 1: Discrete Semiconductor Products; Speed: Fast Recovery =< 500ns, > 200mA (Io); Supplier 1: Digi-Key; Supplier Part Number 1: 641-1015-1-ND; RoHS 1: RoHS Compliant; Description 1: DIODE SCHOTTKY 40V 1A DO214AC; Stock 1: 527910; Pricing 1: 1=0.37, 10=0.338, 100=0.1893, 500=0.1014, 1000=0.06895 (USD); Packaging: Cut Tape (CT); Part Status: Active; Diode Type: Schottky; Current - Average Rectified (Io): 1A; Capacitance @ Vr, F: -; Mounting Type: Surface Mount; Package / Case: DO-214AC, SMA; Supplier Device Package: DO-214AC (SMA); Operating Temperature - Junction: -65°C ~ 125°C; Base Part Number: CDBA140; ComponentLink1URL: http://www.comchiptech.com/admin/files/product/CDBA140-HF%20Thru192841.%20CDBA1100-HF%20RevB.pdf; ComponentLink1Description: http://www.comchiptech.com/admin/files/product/CDBA140-HF%20Thru192841.%20CDBA1100-HF%20RevB.pdf
F1 = Filter_SBSPP0500683MX
IC6 = LM5002: Manufacturer 1: Texas Instruments; Manufacturer Part Number 1: LM5002SD/NOPB; Description 1: IC REG MULT CONFIG ISO ADJ 8WSON; Category 1: Integrated Circuits (ICs); Function: Step-Up, Step-Up/Step-Down; Output Configuration: Positive, Isolation Capable; Topology: Boost, Flyback, Forward Converter, SEPIC; Output Type: Adjustable; Number of Outputs: 1; Voltage - Input (Min): 3.1V; Voltage - Input (Max): 75V; Voltage - Output (Max): 76V (Switch); Current - Output: 400mA (Switch); Frequency - Switching: 50kHz ~ 1.5MHz; Synchronous Rectifier: No; Supplier 1: Digi-Key; Supplier Part Number 1: LM5002SD/NOPBTR-ND; RoHS 1: RoHS Compliant; Stock 1: 3000; Pricing 1: 1000=1.9656, 2000=1.86732, 5000=1.79712 (USD); Packaging: Tape & Reel (TR); Part Status: Active; Voltage - Output (Min/Fixed): 3.1V; Operating Temperature: -40°C ~ 125°C (TJ); Mounting Type: Surface Mount; Package / Case: 8-WDFN Exposed Pad; Supplier Device Package: 8-WSON (4x4); ComponentLink1URL: http://www.ti.com/lit/ds/symlink/lm5002.pdf; ComponentLink1Description: http://www.ti.com/lit/ds/symlink/lm5002.pdf; Base Part Number: LM5002
IC7 = BD70GA5WEFJ-E2: Manufacturer 1: Texas Instruments; Manufacturer Part Number 1: LM5002SD/NOPB; Description 1: IC REG MULT CONFIG ISO ADJ 8WSON; Category 1: Integrated Circuits (ICs); Function: Step-Up, Step-Up/Step-Down; Output Configuration: Positive, Isolation Capable; Topology: Boost, Flyback, Forward Converter, SEPIC; Output Type: Adjustable; Number of Outputs: 1; Voltage - Input (Min): 3.1V; Voltage - Input (Max): 75V; Voltage - Output (Max): 76V (Switch); Current - Output: 400mA (Switch); Frequency - Switching: 50kHz ~ 1.5MHz; Synchronous Rectifier: No; Supplier 1: Digi-Key; Supplier Part Number 1: LM5002SD/NOPBTR-ND; RoHS 1: RoHS Compliant; Stock 1: 3000; Pricing 1: 1000=1.9656, 2000=1.86732, 5000=1.79712 (USD); Packaging: Tape & Reel (TR); Part Status: Active; Voltage - Output (Min/Fixed): 3.1V; Operating Temperature: -40°C ~ 125°C (TJ); Mounting Type: Surface Mount; Package / Case: 8-WDFN Exposed Pad; Supplier Device Package: 8-WSON (4x4); ComponentLink1URL: http://www.ti.com/lit/ds/symlink/lm5002.pdf; ComponentLink1Description: http://www.ti.com/lit/ds/symlink/lm5002.pdf
IC8 IC11 = AP2210N-5: AP2210N-5.0TRG1DICT-ND
IC9 = AP2210N-3.3: AP2210N-3.3TRG1DICT-ND
L1 = FIXED IND 330UH 1.15A 580 MOHM: Manufacturer 1: BOURNS; Manufacturer Part Number 1: SRR1260-331K; Description 1: BOURNS - SRR1260-331K - INDUCTOR, SHIELDED, 330UH, 1.1A, SMD; Inductance: 330; RMS Current (Irms): 1.15; Inductor Construction: Shielded; Saturation Current (Isat): 1.1; Product Range: SRR1260 Series; Power Inductor Case: 12.5mm x 12.5mm x 6; Q Factor: 22; Supplier 1: Farnell; Supplier Part Number 1: 2458509; RoHS 1: YES; Stock 1: 143; Pricing 1: 1=0.843, 10=0.721, 25=0.661, 50=0.6, 100=0.552 (GBP); ComponentLink1URL: http://www.farnell.com/datasheets/2251090.pdf; ComponentLink1Description: http://www.farnell.com/datasheets/2251090.pdf
L2 L3 = induktor_0806: Manufacturer 1: BOURNS; Manufacturer Part Number 1: SRR1260-331K; Description 1: BOURNS - SRR1260-331K - INDUCTOR, SHIELDED, 330UH, 1.1A, SMD; Inductance: 330; RMS Current (Irms): 1.15; Inductor Construction: Shielded; Saturation Current (Isat): 1.1; Product Range: SRR1260 Series; Power Inductor Case: 12.5mm x 12.5mm x 6; Q Factor: 22; Supplier 1: Farnell; Supplier Part Number 1: 2458509; RoHS 1: YES; Stock 1: 143; Pricing 1: 1=0.843, 10=0.721, 25=0.661, 50=0.6, 100=0.552 (GBP); ComponentLink1URL: http://www.farnell.com/datasheets/2251090.pdf; ComponentLink1Description: http://www.farnell.com/datasheets/2251090.pdf
R16 R17 R19 R20 = CRCW0805xxxxJN Default: as R1 on sheet Elreg_Sender
R18 R24 = CRCW08051K00FKEA: RES 1 KOHM 1/8W 1% 0805 SMD; Manufacturer 1: Vishay Dale; Description 1: RES SMD 1K OHM 1% 1/8W 0805; Category 1: Resistors; Resistance (Ohms): 1k; Power (Watts): 0.125W, 1/8W; Temperature Coefficient: ±100ppm/°C; Description 2: Thick Film Resistors - SMD 1/8watt 1Kohms 1% 100ppm; Category 2: Thick Film Resistors - SMD; Power Rating: 125 mW (1/8 W); Resistance: 1 kOhms; Voltage Rating: 150 V; Brand: Vishay / Dale; Supplier 1: Digi-Key; Supplier Part Number 1: 541-1.00KCCT-ND; Manufacturer Part Number 1: CRCW08051K00FKEA; RoHS 1: RoHS Compliant; Packaging: Cut Tape (CT); Tolerance: ±1%; Composition: Thick Film; Features: Automotive AEC-Q200; Operating Temperature: -55°C ~ 155°C; Package / Case: 0805 (2012 Metric); Supplier Device Package: 0805 (2012 Metric); Size / Dimension: 0.079" L x 0.049" W (2.00mm x 1.25mm); Height: 0.020" (0.50mm); ComponentLink1URL: http://www.vishay.com/docs/20035/dcrcwe3.pdf; ComponentLink1Description: http://www.vishay.com/docs/20035/dcrcwe3.pdf; Supplier 2: Mouser; Supplier Part Number 2: 71-CRCW0805-1.0K-E3; Manufacturer 2: Vishay; Manufacturer Part Number 2: CRCW08051K00FKEA; RoHS 2: RoHS Compliant By Exemption; Length: 2 mm; Operating Temperature Range: - 55 C to + 155 C; Package/Case: 0805 (2012 metric); Product: Thick Film Resistors SMD; Series: CRCW; Termination Style: SMD/SMT; Width: 1.25 mm; Case Code - in: 0805; Case Code - mm: 2012; Product Category: 0805 Thick Film Chip Resistors; Standard Pack Qty: 5000; RoHS - Mouser: E; Minimum Order Quantity: 1; Reeling: True; ComponentLink2URL: http://www.mouser.com/ds/2/427/dcrcwe3-109170.pdf; ComponentLink2Description: http://www.mouser.com/ds/2/427/dcrcwe3-109170.pdf
TP5 = Test_Point

## Sheet Elreg_Sender_CH2.SchDoc
size A
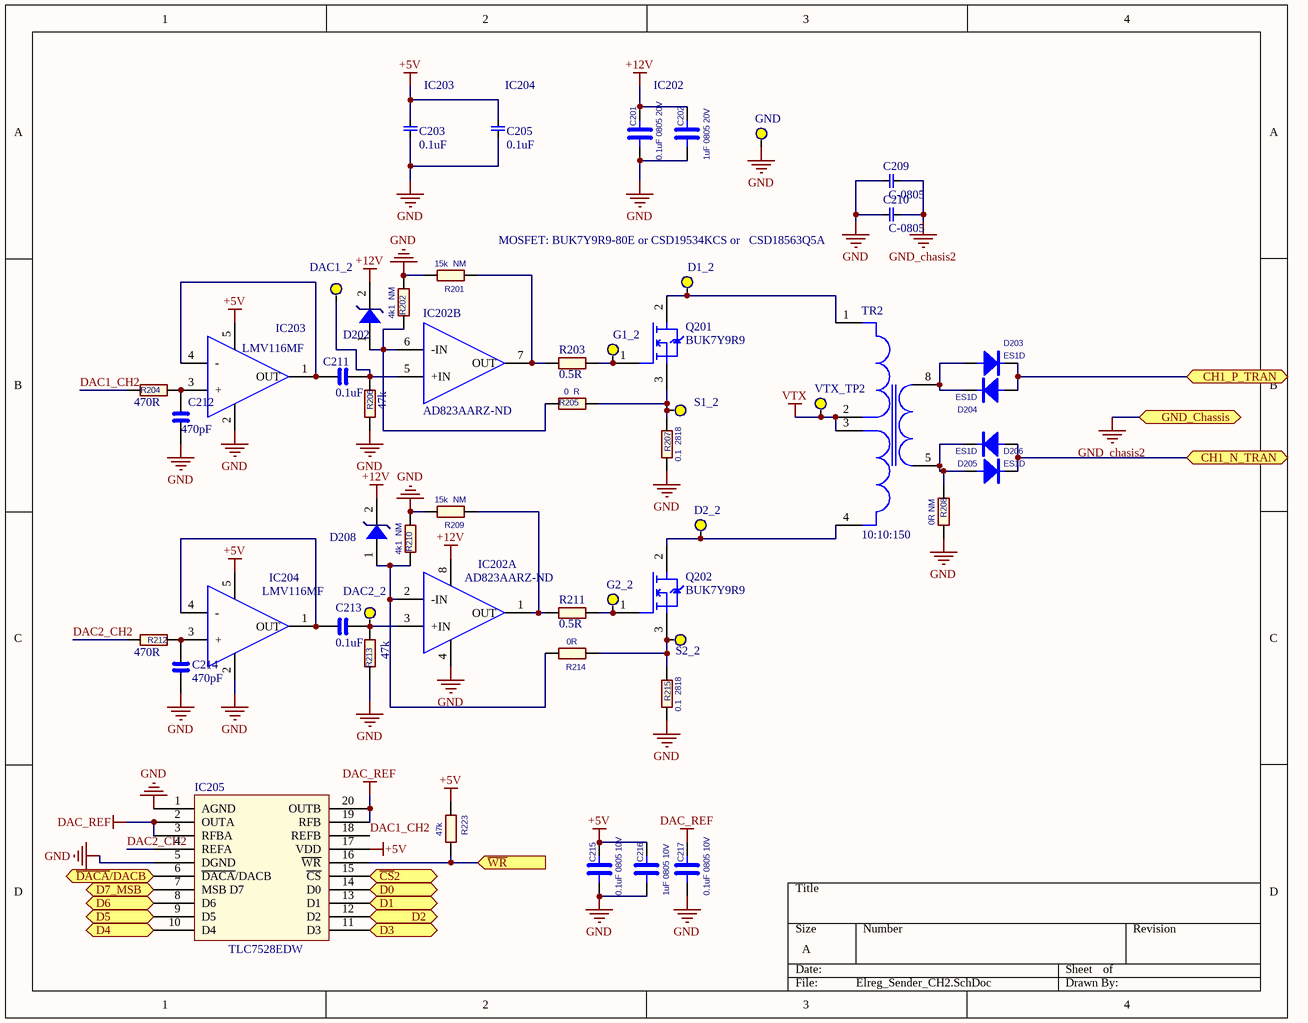
[diagram p3: Elreg_Sender_CH2.SchDoc]

### Parts
C201  0.1uF 0805 20V  [C-0603]
C202  1uF 0805 20V  [C-0603]
C203  0.1uF  [C-0603]
C205  0.1uF  [C-0603]
C209  C-0805  [C-0805]
C210  C-0805  [C-0805]
C211  0.1uF  [C-0603]
C212  470pF  [C-0603]
C213  0.1uF  [C-0603]
C214  470pF  [C-0603]
C215  0.1uF 0805 10V  [C-0603]
C216  1uF 0805 10V  [C-0603]
C217  0.1uF 0805 10V  [C-0603]
D1_2  Test_Point  [Test_Point]  (value not drawn)
D2_2  Test_Point  [Test_Point]  (value not drawn)
D202  Zener 12V  [DFN380P520X45-2N]  (value not drawn)
D203  ES1D  [SMA]
D204  ES1D  [SMA]
D205  ES1D  [SMA]
D206  ES1D  [SMA]
D208  Zener 12V  [DFN380P520X45-2N]  (value not drawn)
DAC1_2  DAC2_2  [Test_Point]  (value not drawn)
DAC2_2  DAC2_2  [Test_Point]  (value not drawn)
G1_2  Test_Point  [Test_Point]  (value not drawn)
G2_2  Test_Point  [Test_Point]  (value not drawn)
IC202  AD823AARZ-ND  [TSOP65P280X110-8N]  (parts A,B of 2)
IC203  LMV116MF  [SOT-23-5]
IC204  LMV116MF  [SOT-23-5]
IC205  TLC7528EDW  [SOIC-20]
Q201  BUK7Y9R9  [BUK7Y9R)]
Q202  BUK7Y9R9  [BUK7Y9R)]
R201  15k  NM  [R-0603]
R202  4k1  NM  [R-0603]
R203  0.5R  [R-0603]
R204  470R  [R-0603]
R205  0  R  [R-0603]
R206  47k  [R-0603]
R207  0.1  2818  [RES2818]
R208  0R NM  [RES-0805]
R209  15k  NM  [R-0603]
R210  4k1  NM  [R-0603]
R211  0.5R  [R-0603]
R212  470R  [R-0603]
R213  47k  [R-0603]
R214  0R  [R-0603]
R215  0.1  2818  [RES2818]
R223  47k  [R-0603]
S1_2  Test_Point  [Test_Point]  (value not drawn)
S2_2  Test_Point  [Test_Point]  (value not drawn)
TP6  GND  [Test_Point]
TR2  10:10:150  [Trafo_15x15]
VTX_TP2  Test_Point  [Test_Point]  (value not drawn)

### Ports
CH1_N_TRAN (bidir), CH1_P_TRAN (bidir), D0 (in), D1 (in), D2 (in), D3 (in), D4 (in), D5 (in), D6 (in), D7_MSB (in), GND_Chassis (bidir), ~{CS}2 (in), ~{DACA}/DACB (in), ~{WR} (in)

### Nets
+5V: C203.2(G) C205.2(G) C215.2 C216.2 IC203.5(+Vs) IC204.5(+Vs) IC205.17(VDD) R223.2
+12V: C201.2 C202.2 D202.2(A) D208.2(A) IC202.8(+Vs)
DAC_REF: C217.2 IC205.2(OUTA) IC205.3(RFBA) IC205.19(RFB) IC205.20(OUTB)
GND: C201.1 C202.1 C203.1(G) C205.1(G) C209.1(G) C210.1(G) C212.2 C214.1 C215.1 C216.1 C217.1 IC202.4(-Vs) IC203.2(-Vs) IC204.2(-Vs) IC205.1(AGND) IC205.5(DGND) R201.1 R202.2 R206.1 R207.2 R208.1 R209.1 R210.2 R213.2 R215.2 TP6.1
GND_chasis2: C209.2(G) C210.2(G) ; port GND_Chassis
VTX: TR2.2(G) TR2.3(G) VTX_TP2.1
28: IC205.7(MSB_D7) ; port D7_MSB
29: IC205.9(D5) ; port D5
32: IC205.6(~{DACA}/DACB) ; port ~{DACA}/DACB
33: IC205.8(D6) ; port D6
38: IC205.11(D3) ; port D3
39: IC205.13(D1) ; port D1
41: IC205.10(D4) ; port D4
43: IC205.12(D2) ; port D2
44: IC205.15(~{CS}) ; port ~{CS}2
45: IC205.16(~{WR}) R223.1 ; port ~{WR}
46: IC205.14(D0) ; port D0
DAC1_CH2: IC205.18(REFB) R204.1
DAC2_CH2: IC205.4(REFA) R212.1
NetC44_1: D203.2(C) D204.1(A) ; port CH1_P_TRAN
NetC45_1: D205.1(A) D206.2(C) ; port CH1_N_TRAN
NetC211_1: C211.1 DAC1_2.1 IC202.5(+IN) R206.2
NetC211_2: C211.2 IC203.1(OUT) IC203.4(-)
NetC212_1: C212.1 IC203.3(+) R204.2
NetC213_1: C213.1 DAC2_2.1 IC202.3(+IN) R213.1
NetC213_2: C213.2 IC204.1(OUT) IC204.4(-)
NetC214_2: C214.2 IC204.3(+) R212.2
NetD1_2_1: D1_2.1 Q201.2(G) TR2.1(G)
NetD2_2_1: D2_2.1 Q202.2(G) TR2.4(G)
NetD202_1: D202.1(A) IC202.6(-IN) R202.1 R205.1
NetD203_1: D203.1(A) D204.2(C) TR2.8(G)
NetD205_2: D205.2(C) D206.1(A) R208.2 TR2.5(G)
NetD208_1: D208.1(A) IC202.2(-IN) R210.1 R214.1
NetG1_2_1: G1_2.1 Q201.1(G) R203.2
NetG2_2_1: G2_2.1 Q202.1(G) R211.2
NetIC202_1: IC202.1(OUT) R209.2 R211.1
NetIC202_7: IC202.7(OUT) R201.2 R203.1
NetQ201_3: Q201.3(G) R205.2 R207.1 S1_2.1
NetQ202_3: Q202.3(G) R214.2 R215.1 S2_2.1

### Notes on the sheet
- IC203
- (near C205) IC204
- IC202
- MOSFET: BUK7Y9R9-80E or CSD19534KCS or   CSD18563Q5A

### Library data of the parts
C201 C202 C215-C217 = 0805CAPxxrrrrv: CAP CER rrrrUF xV x% type 0805
C203 C205 = C-0805_3_3uF: as C3 on sheet Elreg_Sender; Packaging: Cut Tape (CT); Part Status: Active; Operating Temperature: -55°C ~ 125°C; Features: -; Ratings: -; Applications: General Purpose; Failure Rate: -; Mounting Type: Surface Mount, MLCC; Package / Case: 1206 (3216 Metric); Size / Dimension: 0.126" L x 0.063" W (3.20mm x 1.60mm); Height - Seated (Max): -; Thickness (Max): 0.057" (1.45mm); Lead Spacing: -; Lead Style: -; ComponentLink1URL: http://www.yageo.com/documents/recent/UPY-NP0X7R_MV_100-to-630V_21.pdf; ComponentLink1Description: http://www.yageo.com/documents/recent/UPY-NP0X7R_MV_100-to-630V_21.pdf; Supplier 1: Digi-Key; Supplier Part Number 1: 311-1506-1-ND; RoHS 1: RoHS Compliant; Stock 1: 4928; Pricing 1: 1=0.31, 10=0.214, 100=0.1085, 500=0.07424, 1000=0.06568 (USD)
C209 C210 = C-0805: as C9 on sheet Elreg_Sender; Packaging: Cut Tape (CT); Part Status: Active; Operating Temperature: -55°C ~ 125°C; Features: -; Ratings: -; Applications: General Purpose; Failure Rate: -; Mounting Type: Surface Mount, MLCC; Package / Case: 1206 (3216 Metric); Size / Dimension: 0.126" L x 0.063" W (3.20mm x 1.60mm); Height - Seated (Max): -; Thickness (Max): 0.057" (1.45mm); Lead Spacing: -; Lead Style: -; ComponentLink1URL: http://www.yageo.com/documents/recent/UPY-NP0X7R_MV_100-to-630V_21.pdf; ComponentLink1Description: http://www.yageo.com/documents/recent/UPY-NP0X7R_MV_100-to-630V_21.pdf; Supplier 1: Digi-Key; Supplier Part Number 1: 311-1506-1-ND; RoHS 1: RoHS Compliant; Stock 1: 4928; Pricing 1: 1=0.31, 10=0.214, 100=0.1085, 500=0.07424, 1000=0.06568 (USD)
C211 C213 = C-0603_0_1u_10V: as C11 on sheet Elreg_Sender
C212 C214 = C-0603_470p_10V: as C12 on sheet Elreg_Sender
D202 D208 = Zener 12V: as D2 on sheet Elreg_Sender; Supplier 1: Digi-Key; Supplier Part Number 1: 641-1015-1-ND; RoHS 1: RoHS Compliant; Stock 1: 527910; Pricing 1: 1=0.37, 10=0.338, 100=0.1893, 500=0.1014, 1000=0.06895 (USD); Packaging: Cut Tape (CT); Part Status: Active; Capacitance @ Vr, F: -; Mounting Type: Surface Mount; Package / Case: DO-214AC, SMA; Supplier Device Package: DO-214AC (SMA); Operating Temperature - Junction: -65°C ~ 125°C; Base Part Number: CDBA140; ComponentLink1URL: http://www.comchiptech.com/admin/files/product/CDBA140-HF%20Thru192841.%20CDBA1100-HF%20RevB.pdf; ComponentLink1Description: http://www.comchiptech.com/admin/files/product/CDBA140-HF%20Thru192841.%20CDBA1100-HF%20RevB.pdf
D203-D206 = ES1x: as D3 on sheet Elreg_Sender; Supplier 1: Digi-Key; Supplier Part Number 1: ES1DFSTR-ND; Manufacturer Part Number: ES1D; RoHS: RoHS Compliant; Category: Discrete Semiconductor Products; Stock 1: 135000; Pricing 1: 7500=0.0567, 15000=0.0504, 37500=0.04725, 52500=0.0419, 187500=0.04032 (USD); Packaging: Tape & Reel (TR); Part Status: Active; Mounting Type: Surface Mount; Package / Case: DO-214AC, SMA; Supplier Device Package: SMA (DO-214AC); Operating Temperature - Junction: -55°C ~ 150°C; ComponentLink1URL: https://www.fairchildsemi.com/datasheets/ES/ES1A.pdf; ComponentLink1Description: https://www.fairchildsemi.com/datasheets/ES/ES1A.pdf
DAC1_2 DAC2_2 TP6 = Test_Point
IC202 = AD823AARZ-ND: IC OPAMP JFET 16MHZ RRO 8-MSOP; Supplier 1: Digi-Key; Supplier Part Number 1: AD823ARZ-ND
R201 R202 R205 R208-R210 R214 R223 = CRCW0805xxxxJN Default: as R1 on sheet Elreg_Sender
R203 R211 = RES-0805
R204 R212 = R-0603_470R: as R4 on sheet Elreg_Sender; Supplier 1: Digi-Key; Supplier Part Number 1: 541-150ADKR-ND; RoHS 1: RoHS Compliant; Packaging: Digi-Reel®; Composition: Thick Film; Features: Automotive AEC-Q200 Qualified; Package / Case: 0805 (2012 Metric); Supplier Device Package: 0805 (2012 Metric); Size / Dimension: 0.079" L x 0.049" W (2.00mm x 1.25mm); Height: 0.020" (0.50mm); ComponentLink1URL: http://www.vishay.com/doc?20035; ComponentLink1Description: http://www.vishay.com/doc?20035; Supplier 2: Mouser; Supplier Part Number 2: 71-CRCW0805150RJNEA; Manufacturer 2: Vishay; Manufacturer Part Number 2: CRCW0805150RJNEA; RoHS 2: RoHS Compliant By Exemption; Dimensions: 1.25 mm W x 2 mm L x 0.45 mm H; Operating Temperature Range: - 55 C to + 155 C; Product: Thick Film Resistors SMD; Series: CRCW; Termination Style: SMD/SMT; Case Code - in: 0805; Case Code - mm: 2012; Product Category: 0805 Thick Film Chip Resistors; Standard Pack Qty: 5000; RoHS - Mouser: E; Minimum Order Quantity: 1; Reeling: True; ComponentLink2URL: http://www.mouser.com/ds/2/427/dcrcwe3-109170.pdf; ComponentLink2Description: http://www.mouser.com/ds/2/427/dcrcwe3-109170.pdf; Supplier 3: Farnell; Supplier Part Number 3: 1514819; Manufacturer 3: VISHAY DALE; Manufacturer Part Number 3: CRCW0805150RJNEA; RoHS 3: YES; ComponentLink3URL: http://www.farnell.com/cad/1552534.zip; ComponentLink3Description: http://www.farnell.com/cad/1552534.zip
R206 R213 = R-0603_47k: as R6 on sheet Elreg_Sender; Supplier 1: Digi-Key; Supplier Part Number 1: 541-150ADKR-ND; RoHS 1: RoHS Compliant; Packaging: Digi-Reel®; Composition: Thick Film; Features: Automotive AEC-Q200 Qualified; Package / Case: 0805 (2012 Metric); Supplier Device Package: 0805 (2012 Metric); Size / Dimension: 0.079" L x 0.049" W (2.00mm x 1.25mm); Height: 0.020" (0.50mm); ComponentLink1URL: http://www.vishay.com/doc?20035; ComponentLink1Description: http://www.vishay.com/doc?20035; Supplier 2: Mouser; Supplier Part Number 2: 71-CRCW0805150RJNEA; Manufacturer 2: Vishay; Manufacturer Part Number 2: CRCW0805150RJNEA; RoHS 2: RoHS Compliant By Exemption; Dimensions: 1.25 mm W x 2 mm L x 0.45 mm H; Operating Temperature Range: - 55 C to + 155 C; Product: Thick Film Resistors SMD; Series: CRCW; Termination Style: SMD/SMT; Case Code - in: 0805; Case Code - mm: 2012; Product Category: 0805 Thick Film Chip Resistors; Standard Pack Qty: 5000; RoHS - Mouser: E; Minimum Order Quantity: 1; Reeling: True; ComponentLink2URL: http://www.mouser.com/ds/2/427/dcrcwe3-109170.pdf; ComponentLink2Description: http://www.mouser.com/ds/2/427/dcrcwe3-109170.pdf; Supplier 3: Farnell; Supplier Part Number 3: 1514819; Manufacturer 3: VISHAY DALE; Manufacturer Part Number 3: CRCW0805150RJNEA; RoHS 3: YES; ComponentLink3URL: http://www.farnell.com/cad/1552534.zip; ComponentLink3Description: http://www.farnell.com/cad/1552534.zip
R207 R215 = CRCW0805xxxxJN Default: as R7 on sheet Elreg_Sender
TR2 = TRAFO_15x15: as TR1 on sheet Elreg_Sender; link PDF: https://www.tdk-electronics.tdk.com/inf/80/db/fer/efd_15_8_5.pdf

## Nets that join several sheets
+5V: Elreg_Sender (8 pins), Elreg_Sender_Power (C34.1 C35.2 IC8.2), Elreg_Sender_CH2 (8 pins)
+6V5: Elreg_Sender_Top (J9.13), Elreg_Sender (C7.2 IC1.3), Elreg_Sender_Power (10 pins)
+12V: Elreg_Sender (5 pins), Elreg_Sender_Power (C40.2 IC10.3 L3.1), Elreg_Sender_CH2 (5 pins)
DAC_REF: Elreg_Sender (7 pins), Elreg_Sender_CH2 (5 pins)
GND: Elreg_Sender_Top (26 pins), Elreg_Sender (29 pins), Elreg_Sender_Power (40 pins), Elreg_Sender_CH2 (26 pins)
GND_chasis2: Elreg_Sender_Top (J13.2), Elreg_Sender_CH2 (C209.2 C210.2)
GND_chasis_1: Elreg_Sender_Top (J2.2), Elreg_Sender (C9.2 C10.2)
VTX: Elreg_Sender (TR1.2 TR1.3 VTX_TP1.1), Elreg_Sender_Power (11 pins), Elreg_Sender_CH2 (TR2.2 TR2.3 VTX_TP2.1)
28: Elreg_Sender_Top (J8.28), Elreg_Sender (IC5.7), Elreg_Sender_CH2 (IC205.7)
29: Elreg_Sender_Top (J8.26), Elreg_Sender (IC5.9), Elreg_Sender_CH2 (IC205.9)
32: Elreg_Sender_Top (J8.27), Elreg_Sender (IC5.6), Elreg_Sender_CH2 (IC205.6)
33: Elreg_Sender_Top (J8.25), Elreg_Sender (IC5.8), Elreg_Sender_CH2 (IC205.8)
38: Elreg_Sender_Top (J8.20), Elreg_Sender (IC5.11), Elreg_Sender_CH2 (IC205.11)
39: Elreg_Sender_Top (J8.18), Elreg_Sender (IC5.13), Elreg_Sender_CH2 (IC205.13)
41: Elreg_Sender_Top (J8.19), Elreg_Sender (IC5.10), Elreg_Sender_CH2 (IC205.10)
43: Elreg_Sender_Top (J8.17), Elreg_Sender (IC5.12), Elreg_Sender_CH2 (IC205.12)
44: Elreg_Sender_Top (J8.16), Elreg_Sender_CH2 (IC205.15)
45: Elreg_Sender_Top (J8.14), Elreg_Sender (IC5.16 R23.1), Elreg_Sender_CH2 (IC205.16 R223.1)
46: Elreg_Sender_Top (J8.15), Elreg_Sender (IC5.14), Elreg_Sender_CH2 (IC205.14)
98: Elreg_Sender_Top (J7.12), Elreg_Sender (IC5.15)
99: Elreg_Sender_Top (J7.13), Elreg_Sender_Power (C4.2 IC6.8 R18.2 R24.1)
NetC44_1: Elreg_Sender_Top (C44.1 J13.3), Elreg_Sender_CH2 (D203.2 D204.1)
NetC45_1: Elreg_Sender_Top (C45.1 J13.1), Elreg_Sender_CH2 (D205.1 D206.2)
NetC244_1: Elreg_Sender_Top (C244.1 J2.3), Elreg_Sender (D3.2 D4.1)
NetC245_1: Elreg_Sender_Top (C245.1 J2.1), Elreg_Sender (D5.2 D6.1)
NetF1_1: Elreg_Sender_Top (J1.1), Elreg_Sender_Power (F1.1)